# EasyEDA schematic RPiHat.json
TITLE: Task10.1; REV: 1.0; Date: 2020-06-01; Sheet: 1/1; Drawn By: mohstein; Company: Your Company
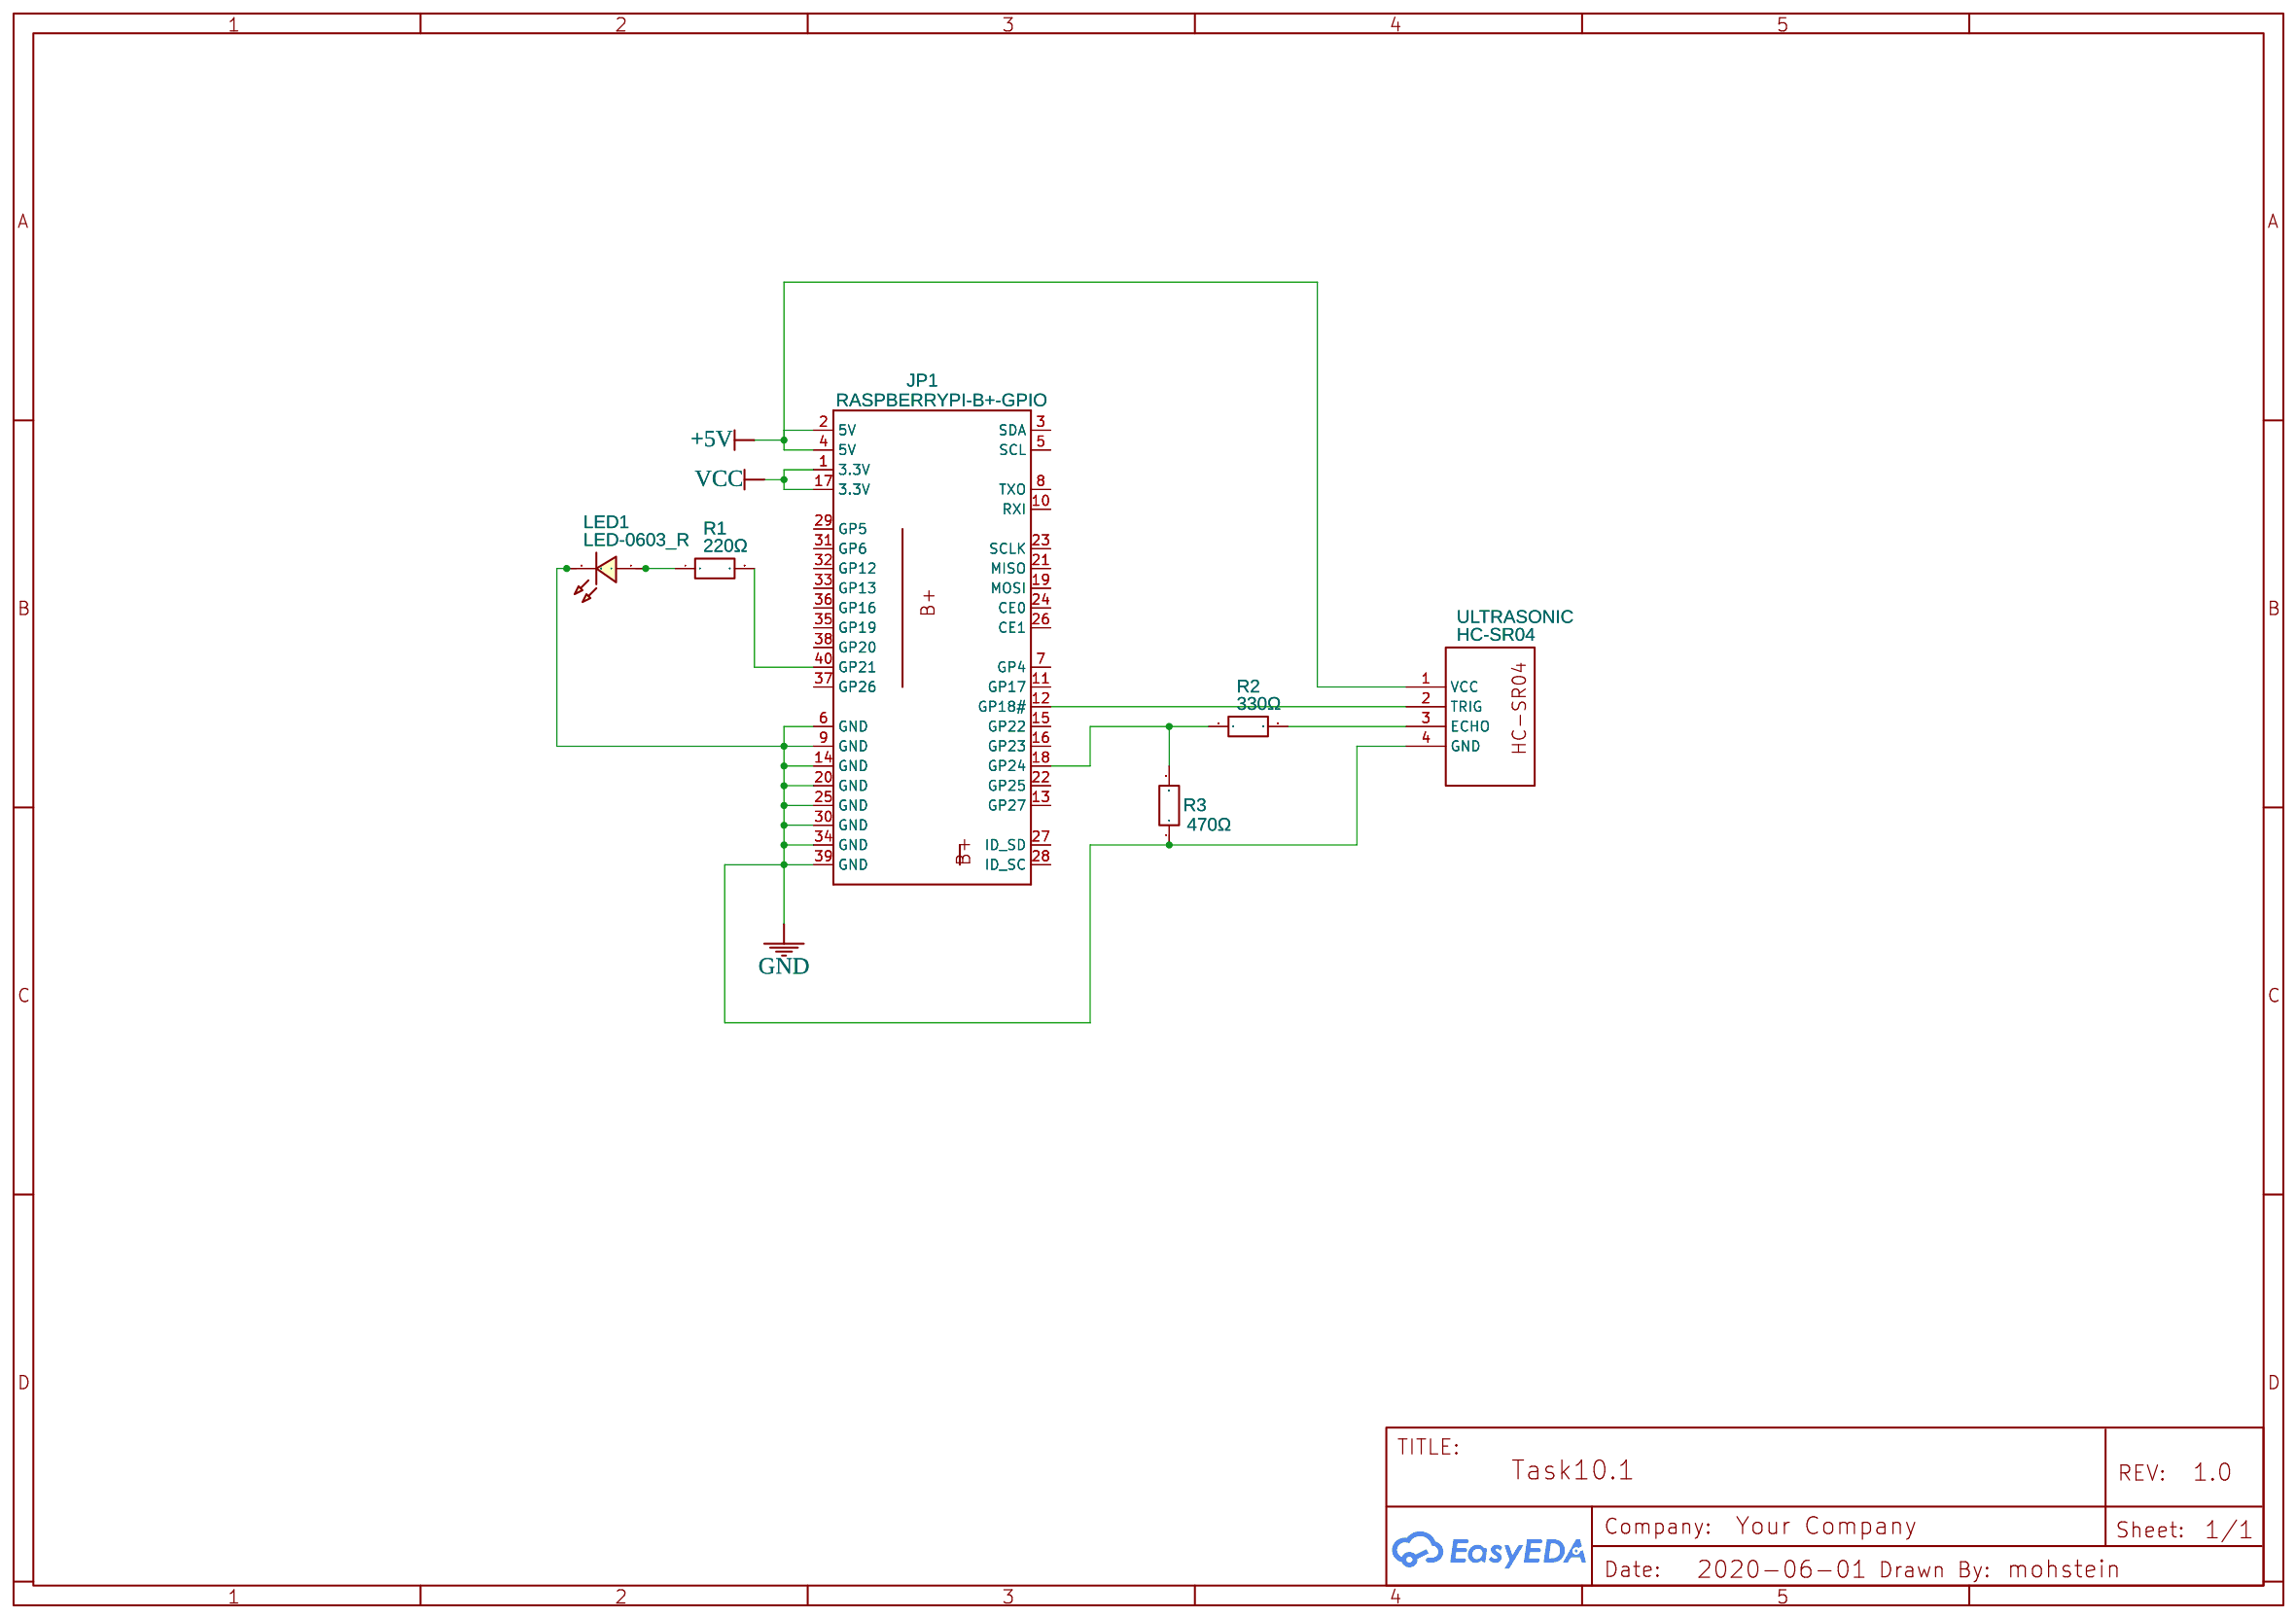
[diagram p0: schematic sheet]

## Parts
JP1  RASPBERRYPI-B+-GPIO  [2X20-SHROUDED]
LED1  LED-0603_R  [LED0603_RED]
R1  220Ω  [R0402]
R2  330Ω  [R0402]
R3  470Ω  [R0402]
ULTRASONIC  HC-SR04  [HC-SR04 ULTRASONIC MODULE]

## Library data of the parts
JP1 = RASPBERRYPI-B+-GPIO: Raspberry Pi B+ GPIO Header; Contributor: SparkFun
LED1 = LED-0603_R: Manufacturer: EVERLIGHT(台湾亿光); Manufacturer Part: 19-217/R6C-AL1M2VY/3T; Supplier Part: C72044; Supplier: LCSC; Contributor: LCEDA_01
R1-R3 = R_0402_EU: Contributor: LCEDA_Lib
ULTRASONIC = HC-SR04: Contributor: Vu Thanh Minh

## Nets
+5V: JP1.2(5V) JP1.4(5V) ULTRASONIC.1(VCC)
GND: JP1.6(GND) JP1.9(GND) JP1.14(GND) JP1.20(GND) JP1.25(GND) JP1.30(GND) JP1.34(GND) JP1.39(GND) LED1.2 R3.1 ULTRASONIC.4(GND)
VCC: JP1.1(3.3V) JP1.17(3.3V)
Net-(JP1-12): JP1.12(GP18#) ULTRASONIC.2(TRIG)
Net-(JP1-18): JP1.18(GP24) R2.1 R3.2
Net-(JP1-40): JP1.40(GP21) R1.2
Net-(LED1-1): LED1.1 R1.1
Net-(R2-2): R2.2 ULTRASONIC.3(ECHO)

Not connected (* = marked no-connect by the designer): JP1 3(SDA) 5(SCL) 7(GP4) 8(TXO) 10(RXI) 11(GP17) 13(GP27) 15(GP22) 16(GP23) 19(MOSI) 21(MISO) 22(GP25) 23(SCLK) 24(CE0) 26(CE1) 27(ID_SD) 28(ID_SC) 29(GP5) 31(GP6) 32(GP12) 33(GP13) 35(GP19) 36(GP16) 37(GP26) 38(GP20)
